# Altium schematic sheet biv2-LRTP_1a.SchDoc
size 420 x 297 mm; Address1: Address1; Address2: Address2; Address3: Address3; Address4: Address4; DocumentNumber: АБВГ.123456.001 Э3; SheetNumber: 1; Scale: 1:1; DocumentType: Схема электрическая принципиальная; FirstReferrence: АБВГ.123456.001
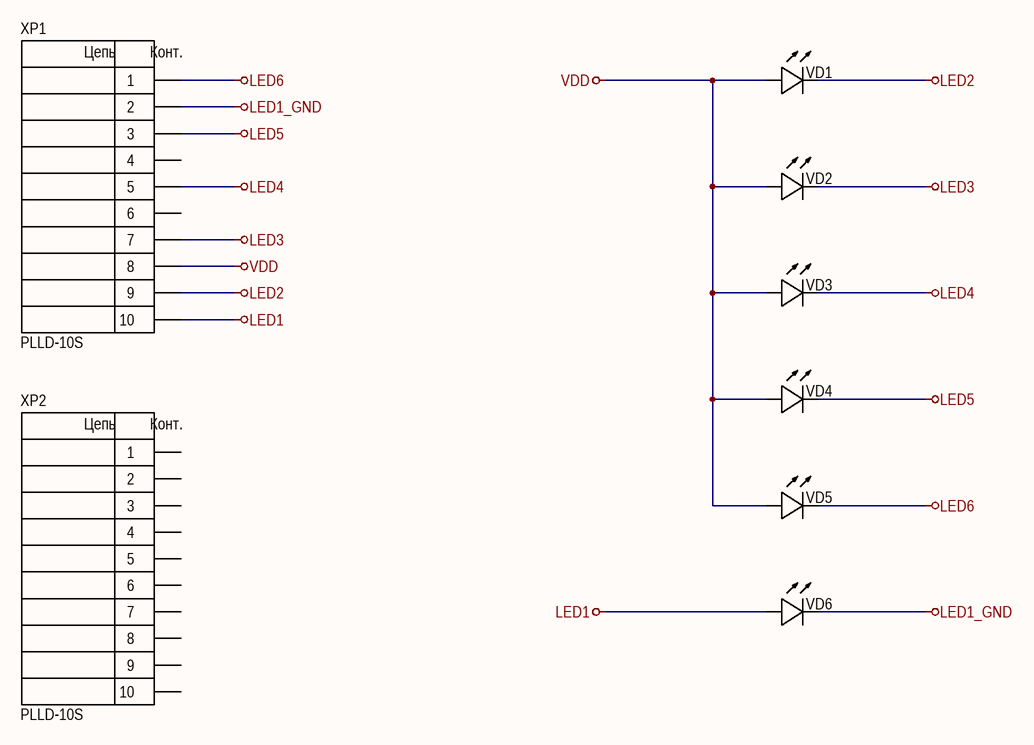
[diagram p0: biv2-LRTP_1a.SchDoc]

## Parts
VD1  KM2520SURCK09  [KM2520SURCK09]  (value not drawn)
VD2  KM2520SURCK09  [KM2520SURCK09]  (value not drawn)
VD3  KM2520SURCK09  [KM2520SURCK09]  (value not drawn)
VD4  KM2520SURCK09  [KM2520SURCK09]  (value not drawn)
VD5  KM2520SURCK09  [KM2520SURCK09]  (value not drawn)
VD6  KM2520SURCK09  [KM2520SURCK09]  (value not drawn)
XP1  PLLD-10S  [CON: PLLD-10S]
XP2  PLLD-10S  [CON: PLLD-10S]

## Nets
LED1: VD6.1(A) XP1.10
LED1_GND: VD6.2(K) XP1.2
LED2: VD1.2(K) XP1.9
LED3: VD2.2(K) XP1.7
LED4: VD3.2(K) XP1.5
LED5: VD4.2(K) XP1.3
LED6: VD5.2(K) XP1.1
VDD: VD1.1(A) VD2.1(A) VD3.1(A) VD4.1(A) VD5.1(A) XP1.8

Not connected (* = marked no-connect by the designer): XP1 4 6; XP2 1 2 3 4 5 6 7 8 9 10

## Notes on the sheet
- Перв. примен.
- Справ. №
- Подп. и дата
- Инв. № дубл.
- Взам. инв. №
- Разраб.
- Изм.
- Лист
- № докум.
- Подп.
- Дата
- Лит.
- Масса
- Масштаб
- Пров.
- Т.контр.
- Листов
- Инв. № подл.
- Утв.
- Н.контр.
- 2.106-A3
- Копировал
- Формат А3
- (in symbol PLLD-10S) Цепь; Конт.

## Library data of the parts
VD1-VD6 = KM2520SURCK09: LED
XP1 XP2 = PLLD-10S: Step 1.27